# EAGLE design VFO (EAGLE 5.07)
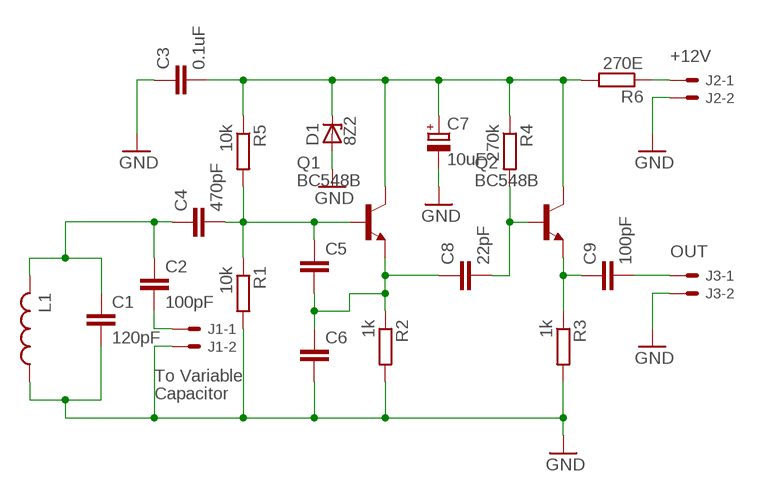
[diagram p0: schematic, sheet 1]

## Parts
C1  120pF  C-EU050-035X075  [C050-035X075]
C2  100pF  C-EU050-035X075  [C050-035X075]
C3  0.1uF  C-EU050-035X075  [C050-035X075]
C4  470pF  C-EU050-035X075  [C050-035X075]
C5  C-EU050-035X075  [C050-035X075]
C6  C-EU050-035X075  [C050-035X075]
C7  10uF  CPOL-EUE2.5-6  [E2,5-6]
C8  22pF  C-EU050-035X075  [C050-035X075]
C9  100pF  C-EU050-035X075  [C050-035X075]
D1  8Z2  ZENER-DIODEDO35Z10  [DO35Z10]
J1  22-27-2021-02  [6410-02]
J2  22-27-2021-02  [6410-02]
J3  22-27-2021-02  [6410-02]
L1  L-US0207/15  [0207/15]
Q1  BC548B  [TO92-EBC]
Q2  BC548B  [TO92-EBC]
R1  10k  R-EU_0207/12  [0207/12]
R2  1k  R-EU_0207/12  [0207/12]
R3  1k  R-EU_0207/12  [0207/12]
R4  270k  R-EU_0207/12  [0207/12]
R5  10k  R-EU_0207/12  [0207/12]
R6  270E  R-EU_0207/12  [0207/12]

## Nets
GND: C1.2 C3.1 C6.2 C7.- D1.A J1.2 J2.2 J3.2 L1.1 R1.2 R2.2 R3.2
N$1: C1.1 C2.1 C4.1 L1.2
N$2: C4.2 C5.1 Q1.B R1.1 R5.2
N$3: C2.2 J1.1
N$4: C5.2 C6.1 C8.1 Q1.E R2.1
N$5: J2.1 R6.1
N$6: C8.2 Q2.B R4.2
N$7: C9.1 Q2.E R3.1
N$8: C3.2 C7.+ D1.C Q1.C Q2.C R4.1 R5.1 R6.2
N$9: C9.2 J3.1

## Notes on the sheet
- +12V
- OUT
- To Variable
- Capacitor

## Library data of the parts
C1-C6 C8 C9 = rcl:C-EU: CAPACITOR, European symbol
C7 = rcl:CPOL-EU: POLARIZED CAPACITOR, European symbol
D1 = diode:ZENER-DIODE: Z-Diode
J1-J3 = con-molex:22-?-02: CONNECTOR wire to board 2.54 mm (.1 inch) pitch header
L1 = rcl:L-US: INDUCTOR, American symbol
Q1 Q2 = transistor-npn:BC548*: NPN Transistor
R1-R6 = rcl:R-EU_: RESISTOR, European symbol

## Board
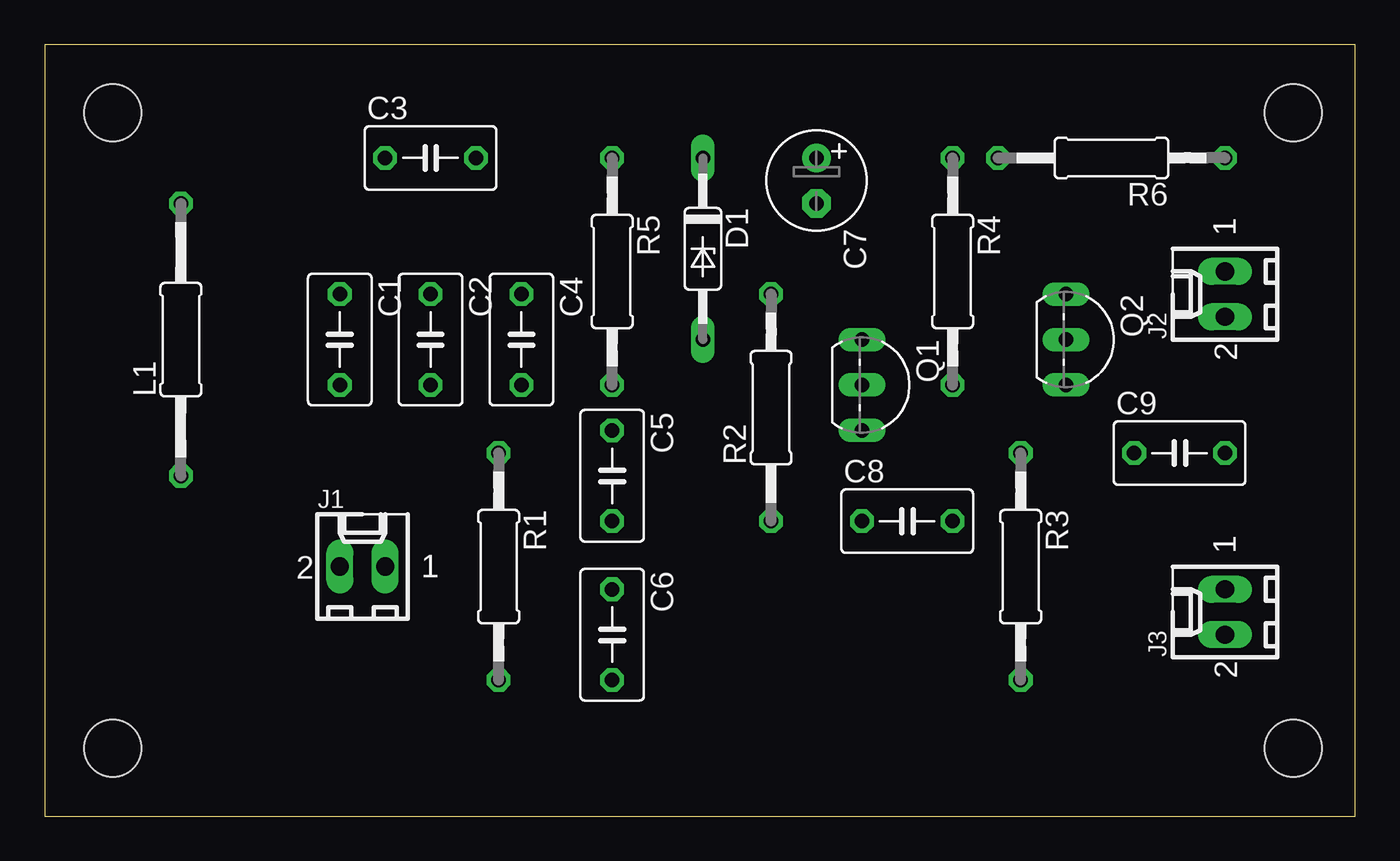
[diagram p1: board, top side]
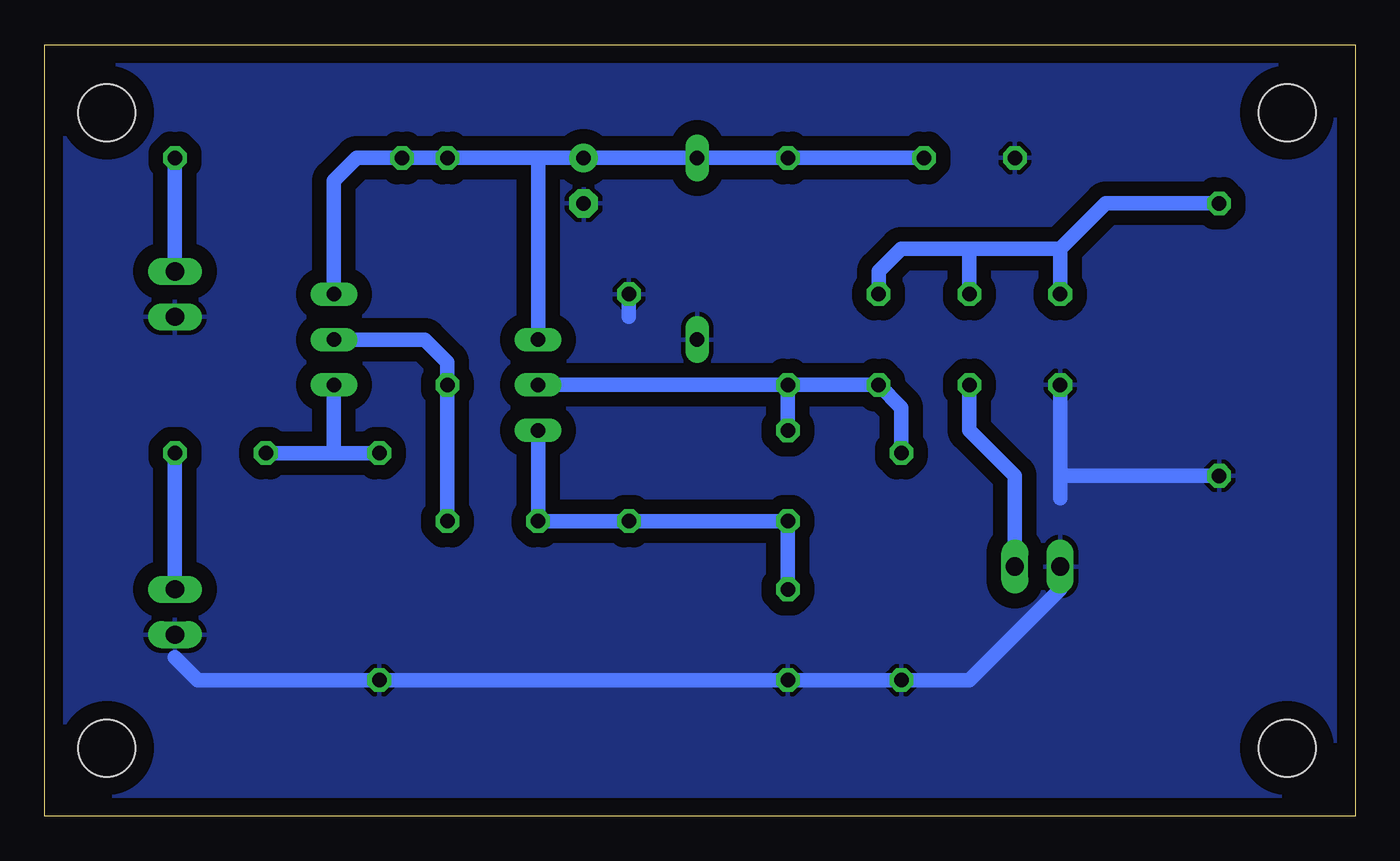
[diagram p2: board, bottom side, seen from below]

Size 73.33 x 43.17 mm. Coordinates in mm from the lower left corner, seen from the top.
Outline: 0,0 73.33,0 73.33,43.17 0,43.17 0,0
Copper layers (1*16): Top 0.035mm / dielectric 1.5mm / Bottom 0.035mm
Design rules "default": minimum track width 10mil, minimum drill 24mil, track to track 8mil, track to pad 8mil, pad to pad 8mil, via to via 8mil, smd to smd 8mil, copper to edge 40mil, drill to drill 8mil, minimum pad ring 10mil, minimum via ring 8mil, stop-mask expansion 4mil, vias tented up to drill 0mil, thermal gap 10mil
Holes 3.2 mm at 69.85,3.81 69.85,39.37 3.81,39.37 3.81,3.81

### Footprints (pad centres in the part's own frame; a part is rotated, then mirrored left to right if it is on the bottom)
C050-035X075 = drill 0.813 octagon: 1 -2.54,0; 2 2.54,0
E2,5-6 = drill 0.813 pad 1.6 round: + -1.27,0 | drill 0.813 pad 1.6 octagon: - 1.27,0
DO35Z10 = drill 0.813 long: A 5.08,0; C -5.08,0
6410-02 = drill 1.016 long: 1 1.27,0; 2 -1.27,0
0207/15 = drill 0.813 octagon: 1 -7.62,0; 2 7.62,0
TO92-EBC = drill 0.813 long: B 0,-1.27; C -2.54,-1.27; E 2.54,-1.27
0207/12 = drill 0.813 octagon: 1 -6.35,0; 2 6.35,0

### Placement (x,y rotation side)
C1  16.51,26.67 270 top
C2  21.59,26.67 270 top
C3  21.59,36.83 0 top
C4  26.67,26.67 270 top
C5  31.75,19.05 270 top
C6  31.75,10.16 270 top
C7  43.18,35.56 270 top
C8  48.26,16.51 0 top
C9  63.5,20.32 0 top
D1  36.83,31.75 270 top
J1  17.78,13.97 0 top
J2  66.04,29.21 90 top
J3  66.04,11.43 90 top
L1  7.62,26.67 90 top
Q1  46.99,24.13 270 top
Q2  58.42,26.67 270 top
R1  25.4,13.97 270 top
R2  40.64,22.86 90 top
R3  54.61,13.97 270 top
R4  50.8,30.48 270 top
R5  31.75,30.48 270 top
R6  59.69,36.83 180 top

### Tracks (layer width: path | path; a pad name or v marks a point on that pad's centre or on a via)
GND
  Bottom 0.813: L1.1 16.51,19.05 | 16.51,19.05 16.51,17.78 | 16.51,19.05 C1.2 | 16.51,12.7 21.59,7.62 R1.2 C6.2 38.1,7.62 R3.2 64.77,7.62 66.04,8.89 | R2.2 40.64,27.94
  pour Bottom (isolate 0.813): 0.5,43 73.31,43 73.31,0.5 0.5,0.5
N$1
  Bottom 0.813: L1.2 13.97,34.29 16.51,31.75 | 16.51,31.75 21.59,31.75 | 21.59,31.75 25.4,31.75 26.67,30.48 C4.1 | 16.51,31.75 C1.1 | 21.59,31.75 C2.1
N$2
  Bottom 0.813: R1.1 25.4,22.86 C4.2 R5.2 | R5.2 C5.1 | R5.2 41.91,24.13 43.18,24.13 Q1.B
N$3
  Bottom 0.813: C2.2 21.59,21.59 19.05,19.05 J1.1
N$4
  Bottom 0.813: C6.1 C5.2 R2.1 44.45,16.51 C8.1 Q1.E
N$5
  Bottom 0.813: J2.1 R6.1
N$6
  Bottom 0.813: C8.2 R4.2 50.8,25.4 52.07,26.67 Q2.B
N$7
  Bottom 0.813: R3.1 57.15,20.32 | 57.15,20.32 C9.1 | 57.15,20.32 Q2.E
N$8
  Bottom 0.813: C3.2 R5.1 D1.C C7.+ 45.72,36.83 | 45.72,36.83 R4.1 R6.2 55.88,36.83 57.15,35.56 Q2.C | 45.72,36.83 Q1.C
N$9
  Bottom 0.813: J3.1 C9.2